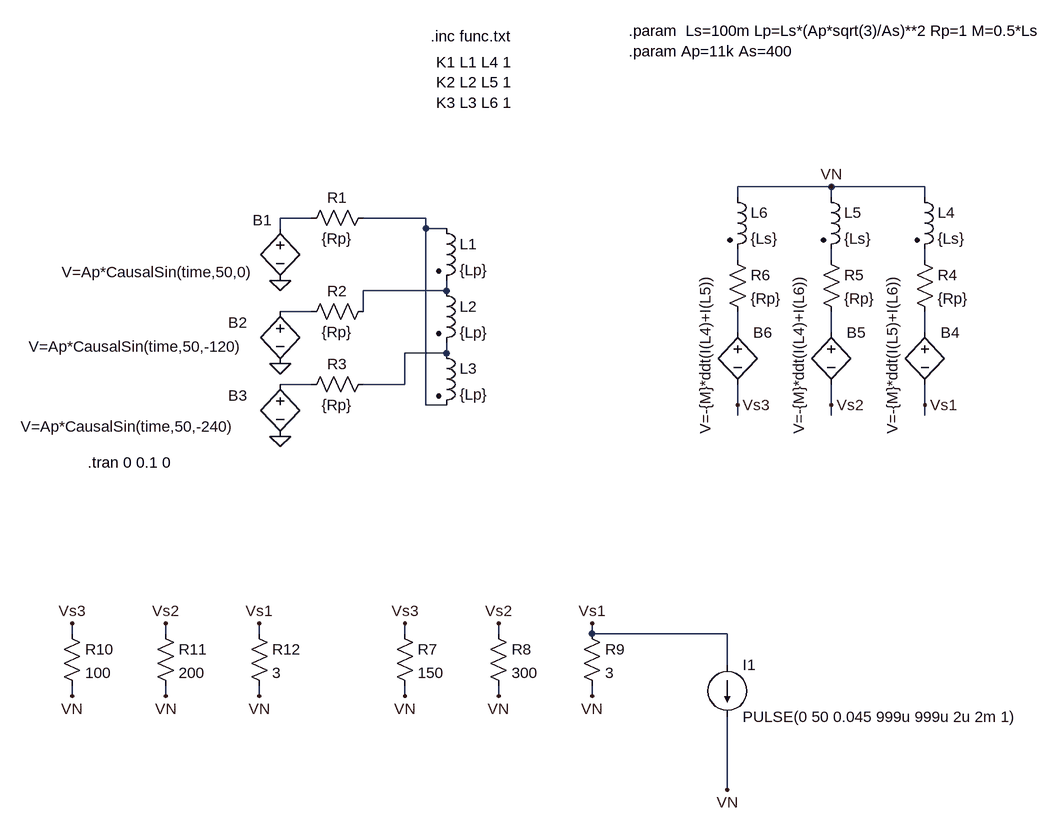
[diagram p0: schematic TransfoTri.asc]
TransfoTri.asc, the LTspice schematic file:
Version 4
SHEET 1 1128 964
WIRE 320 -48 176 -48
WIRE 464 -48 320 -48
WIRE 176 -32 176 -48
WIRE 320 -32 320 -48
WIRE 464 -32 464 -48
WIRE -480 0 -528 0
WIRE -304 0 -400 0
WIRE -528 16 -528 0
WIRE -304 16 -304 0
WIRE -272 16 -304 16
WIRE 176 64 176 48
WIRE 320 64 320 48
WIRE 464 64 464 48
WIRE -272 112 -272 96
WIRE -272 112 -400 112
WIRE -480 144 -528 144
WIRE -400 144 -400 112
WIRE 176 176 176 144
WIRE 320 176 320 144
WIRE 464 176 464 144
WIRE -272 208 -272 192
WIRE -272 208 -336 208
WIRE -480 256 -528 256
WIRE -336 256 -336 208
WIRE -336 256 -400 256
WIRE -304 288 -304 16
WIRE -272 288 -304 288
WIRE 176 288 176 256
WIRE 320 288 320 256
WIRE 464 288 464 256
WIRE 176 304 176 288
WIRE 320 304 320 288
WIRE 464 304 464 288
WIRE -848 640 -848 624
WIRE -704 640 -704 624
WIRE -560 640 -560 624
WIRE -336 640 -336 624
WIRE -192 640 -192 624
WIRE -48 640 -48 624
WIRE 160 640 -48 640
WIRE 160 688 160 640
WIRE -848 736 -848 720
WIRE -704 736 -704 720
WIRE -560 736 -560 720
WIRE -336 736 -336 720
WIRE -192 736 -192 720
WIRE -48 736 -48 720
WIRE 160 880 160 768
FLAG -528 96 0
FLAG -528 224 0
FLAG -528 336 0
FLAG 464 288 Vs1
FLAG 320 288 Vs2
FLAG 176 288 Vs3
FLAG -560 624 Vs1
FLAG -704 624 Vs2
FLAG -848 624 Vs3
FLAG -48 624 Vs1
FLAG -192 624 Vs2
FLAG -336 624 Vs3
FLAG 320 -48 VN
FLAG 160 880 VN
FLAG -48 736 VN
FLAG -192 736 VN
FLAG -336 736 VN
FLAG -560 736 VN
FLAG -704 736 VN
FLAG -848 736 VN
SYMBOL ind2 -288 0 R0
SYMATTR InstName L1
SYMATTR Value {Lp}
SYMATTR Type ind
SYMATTR SpiceLine Rser=1
SYMBOL ind2 -288 96 R0
SYMATTR InstName L2
SYMATTR Value {Lp}
SYMATTR Type ind
SYMATTR SpiceLine Rser=1
SYMBOL ind2 -288 192 R0
SYMATTR InstName L3
SYMATTR Value {Lp}
SYMATTR Type ind
SYMATTR SpiceLine Rser=1
SYMBOL bv -528 0 R0
WINDOW 0 -42 3 Left 2
WINDOW 3 -336 83 Left 2
SYMATTR InstName B1
SYMATTR Value V=Ap*CausalSin(time,50,0)
SYMBOL bv -528 128 R0
WINDOW 0 -80 33 Left 2
WINDOW 3 -387 70 Left 2
SYMATTR InstName B2
SYMATTR Value V=Ap*CausalSin(time,50,-120)
SYMBOL bv -528 240 R0
WINDOW 0 -80 33 Left 2
WINDOW 3 -399 81 Left 2
SYMATTR InstName B3
SYMATTR Value V=Ap*CausalSin(time,50,-240)
SYMBOL res -384 -16 R90
WINDOW 0 0 56 VBottom 2
WINDOW 3 32 56 VTop 2
SYMATTR InstName R1
SYMATTR Value {Rp}
SYMBOL res -384 128 R90
WINDOW 0 0 56 VBottom 2
WINDOW 3 32 56 VTop 2
SYMATTR InstName R2
SYMATTR Value {Rp}
SYMBOL res -384 240 R90
WINDOW 0 0 56 VBottom 2
WINDOW 3 32 56 VTop 2
SYMATTR InstName R3
SYMATTR Value {Rp}
SYMBOL ind2 448 -48 R0
SYMATTR InstName L4
SYMATTR Value {Ls}
SYMATTR Type ind
SYMBOL ind2 304 -48 R0
SYMATTR InstName L5
SYMATTR Value {Ls}
SYMATTR Type ind
SYMBOL ind2 160 -48 R0
SYMATTR InstName L6
SYMATTR Value {Ls}
SYMATTR Type ind
SYMBOL res 448 48 R0
SYMATTR InstName R4
SYMATTR Value {Rp}
SYMBOL res 304 48 R0
SYMATTR InstName R5
SYMATTR Value {Rp}
SYMBOL res 160 48 R0
SYMATTR InstName R6
SYMATTR Value {Rp}
SYMBOL bv 176 160 R0
WINDOW 3 -50 -76 VRight 2
SYMATTR Value V=-{M}*ddt(I(L4)+I(L5))
SYMATTR InstName B6
SYMBOL bv 464 160 R0
WINDOW 3 -50 -76 VRight 2
SYMATTR Value V=-{M}*ddt(I(L5)+I(L6))
SYMATTR InstName B4
SYMBOL bv 320 160 R0
WINDOW 3 -50 -76 VRight 2
SYMATTR Value V=-{M}*ddt(I(L4)+I(L6))
SYMATTR InstName B5
SYMBOL res -864 624 R0
SYMATTR InstName R10
SYMATTR Value 100
SYMBOL res -720 624 R0
SYMATTR InstName R11
SYMATTR Value 200
SYMBOL res -576 624 R0
SYMATTR InstName R12
SYMATTR Value 3
SYMBOL res -352 624 R0
SYMATTR InstName R7
SYMATTR Value 150
SYMBOL res -208 624 R0
SYMATTR InstName R8
SYMATTR Value 300
SYMBOL res -64 624 R0
SYMATTR InstName R9
SYMATTR Value 3
SYMBOL current 160 688 R0
WINDOW 123 0 0 Left 2
WINDOW 39 0 0 Left 2
SYMATTR InstName I1
SYMATTR Value PULSE(0 50 0.045 999u 999u 2u 2m 1)
TEXT -824 376 Left 2 !.tran 0 0.1 0
TEXT 8 -288 Left 2 !.param  Ls=100m Lp=Ls*(Ap*sqrt(3)/As)**2 Rp=1 M=0.5*Ls\n.param Ap=11k As=400
TEXT -296 -280 Left 2 !.inc func.txt
TEXT -288 -240 Left 2 !K1 L1 L4 1\nK2 L2 L5 1\nK3 L3 L6 1

The netlist it stands for:
* TransfoTri.asc
L1 N002 N006 {Lp} Rser=1
L2 N006 N011 {Lp} Rser=1
L3 N011 N002 {Lp} Rser=1
B1 N001 0 V=Ap*CausalSin(time,50,0)
B2 N007 0 V=Ap*CausalSin(time,50,-120)
B3 N012 0 V=Ap*CausalSin(time,50,-240)
R1 N002 N001 {Rp}
R2 N006 N007 {Rp}
R3 N011 N012 {Rp}
L4 VN N005 {Ls}
L5 VN N004 {Ls}
L6 VN N003 {Ls}
R4 N005 N010 {Rp}
R5 N004 N009 {Rp}
R6 N003 N008 {Rp}
B6 N008 Vs3 V=-{M}*ddt(I(L4)+I(L5))
B4 N010 Vs1 V=-{M}*ddt(I(L5)+I(L6))
B5 N009 Vs2 V=-{M}*ddt(I(L4)+I(L6))
R10 Vs3 VN 100
R11 Vs2 VN 200
R12 Vs1 VN 3
R7 Vs3 VN 150
R8 Vs2 VN 300
R9 Vs1 VN 3
I1 Vs1 VN PULSE(0 50 0.045 999u 999u 2u 2m 1)
.tran 0 0.1 0
.param  Ls=100m Lp=Ls*(Ap*sqrt(3)/As)**2 Rp=1 M=0.5*Ls
.param Ap=11k As=400
.inc func.txt
K1 L1 L4 1
K2 L2 L5 1
K3 L3 L6 1
.backanno
.end